# EAGLE design heater_motor (EAGLE 9.4.2)
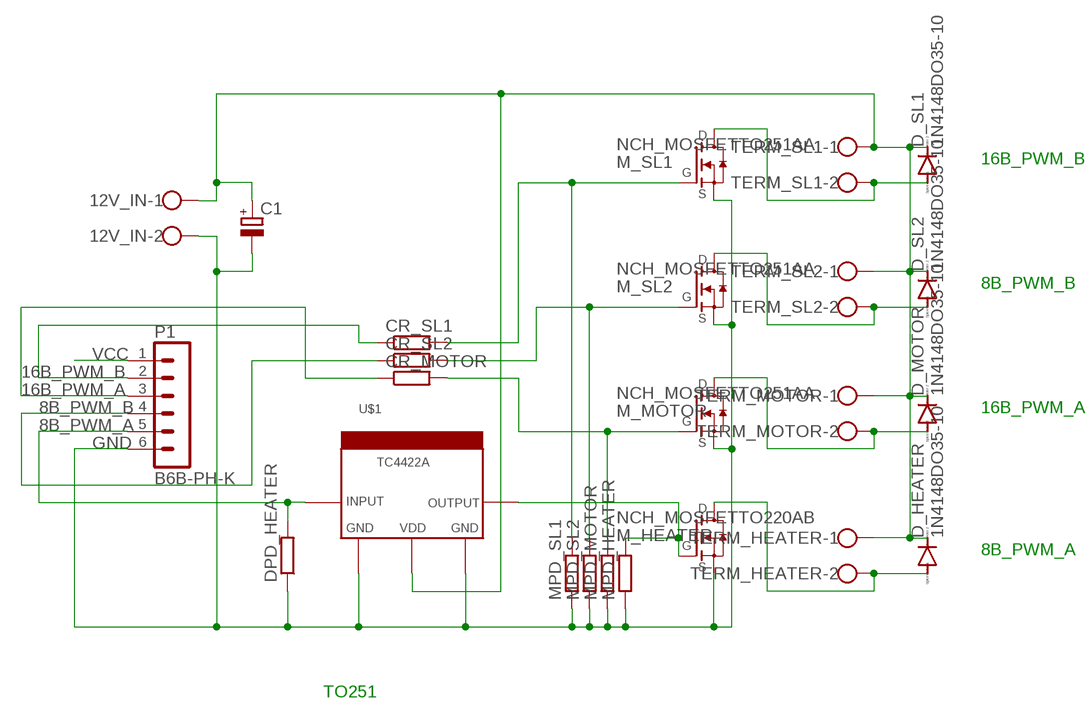
[diagram p0: schematic, sheet 1]

## Parts
12V_IN  W237-102  [W237-102]
C1  CPOL-EUE5-10.5  [E5-10,5]
CR_MOTOR  R-EU_0207/10  [0207/10]
CR_SL1  R-EU_0207/10  [0207/10]
CR_SL2  R-EU_0207/10  [0207/10]
D_HEATER  1N4148DO35-10  [DO35-10]
D_MOTOR  1N4148DO35-10  [DO35-10]
D_SL1  1N4148DO35-10  [DO35-10]
D_SL2  1N4148DO35-10  [DO35-10]
DPD_HEATER  R-EU_0207/10  [0207/10]
M_HEATER  NCH_MOSFETTO220AB  [TO220AB]
M_MOTOR  NCH_MOSFETTO251AA  [TO251AA]
M_SL1  NCH_MOSFETTO251AA  [TO251AA]
M_SL2  NCH_MOSFETTO251AA  [TO251AA]
MPD_HEATER  R-EU_0207/10  [0207/10]
MPD_MOTOR  R-EU_0207/10  [0207/10]
MPD_SL1  R-EU_0207/10  [0207/10]
MPD_SL2  R-EU_0207/10  [0207/10]
P1  B6B-PH-K  [B6B-PH-K]
TERM_HEATER  W237-102  [W237-102]
TERM_MOTOR  W237-102  [W237-102]
TERM_SL1  W237-102  [W237-102]
TERM_SL2  W237-102  [W237-102]
U$1  TC4422ASPACE_LEGS  [TO220-52]

## Nets
8B_PWM_A: DPD_HEATER.2 P1.5 U$1.1(INPUT)
8B_PWM_B: CR_SL2.1 P1.4
16B_PWM_A: CR_MOTOR.1 P1.3
16B_PWM_B: CR_SL1.1 P1.2
GND: 12V_IN.2 C1.- DPD_HEATER.1 M_HEATER.3(S) M_MOTOR.3(S) M_SL1.3(S) M_SL2.3(S) MPD_HEATER.1 MPD_MOTOR.1 MPD_SL1.1 MPD_SL2.1 P1.6 U$1.2(GND1) U$1.4(GND2)
N$1: D_HEATER.A M_HEATER.2(D) TERM_HEATER.2
N$3: M_HEATER.1(G) MPD_HEATER.2 U$1.5(OUTPUT)
N$4: D_SL1.A M_SL1.2(D) TERM_SL1.2
N$5: D_SL2.A M_SL2.2(D) TERM_SL2.2
N$6: D_MOTOR.A M_MOTOR.2(D) TERM_MOTOR.2
N$7: CR_MOTOR.2 M_MOTOR.1(G) MPD_MOTOR.2
N$8: CR_SL2.2 M_SL2.1(G) MPD_SL2.2
N$9: CR_SL1.2 M_SL1.1(G) MPD_SL1.2
N$14: 12V_IN.1 C1.+ D_HEATER.C D_MOTOR.C D_SL1.C D_SL2.C TERM_HEATER.1 TERM_MOTOR.1 TERM_SL1.1 TERM_SL2.1 U$1.3(VDD)
VCC: P1.1

## Notes on the sheet
- 16B_PWM_B
- 8B_PWM_B
- 16B_PWM_A
- 8B_PWM_A
- TO251

## Library data of the parts
12V_IN TERM_HEATER TERM_MOTOR TERM_SL1 TERM_SL2 = con-wago-500:W237-102: WAGO SCREW CLAMP; MPN: 237-102; OC_FARNELL: unknown; OC_NEWARK: 70K9898
C1 = rcl:CPOL-EU: POLARIZED CAPACITOR, European symbol; SPICEPREFIX: C
CR_MOTOR CR_SL1 CR_SL2 DPD_HEATER MPD_HEATER MPD_MOTOR MPD_SL1 MPD_SL2 = rcl:R-EU_: RESISTOR, European symbol; SPICEPREFIX: R
D_HEATER D_MOTOR D_SL1 D_SL2 = diode:1N4148: DIODE high speed (Philips)
M_HEATER M_MOTOR M_SL1 M_SL2 = custom_mosfets:NCH_MOSFET
P1 = con-jst-ph:B6B-PH-K: HEADER
U$1 = custom_mosfets:TC4422A

## Board
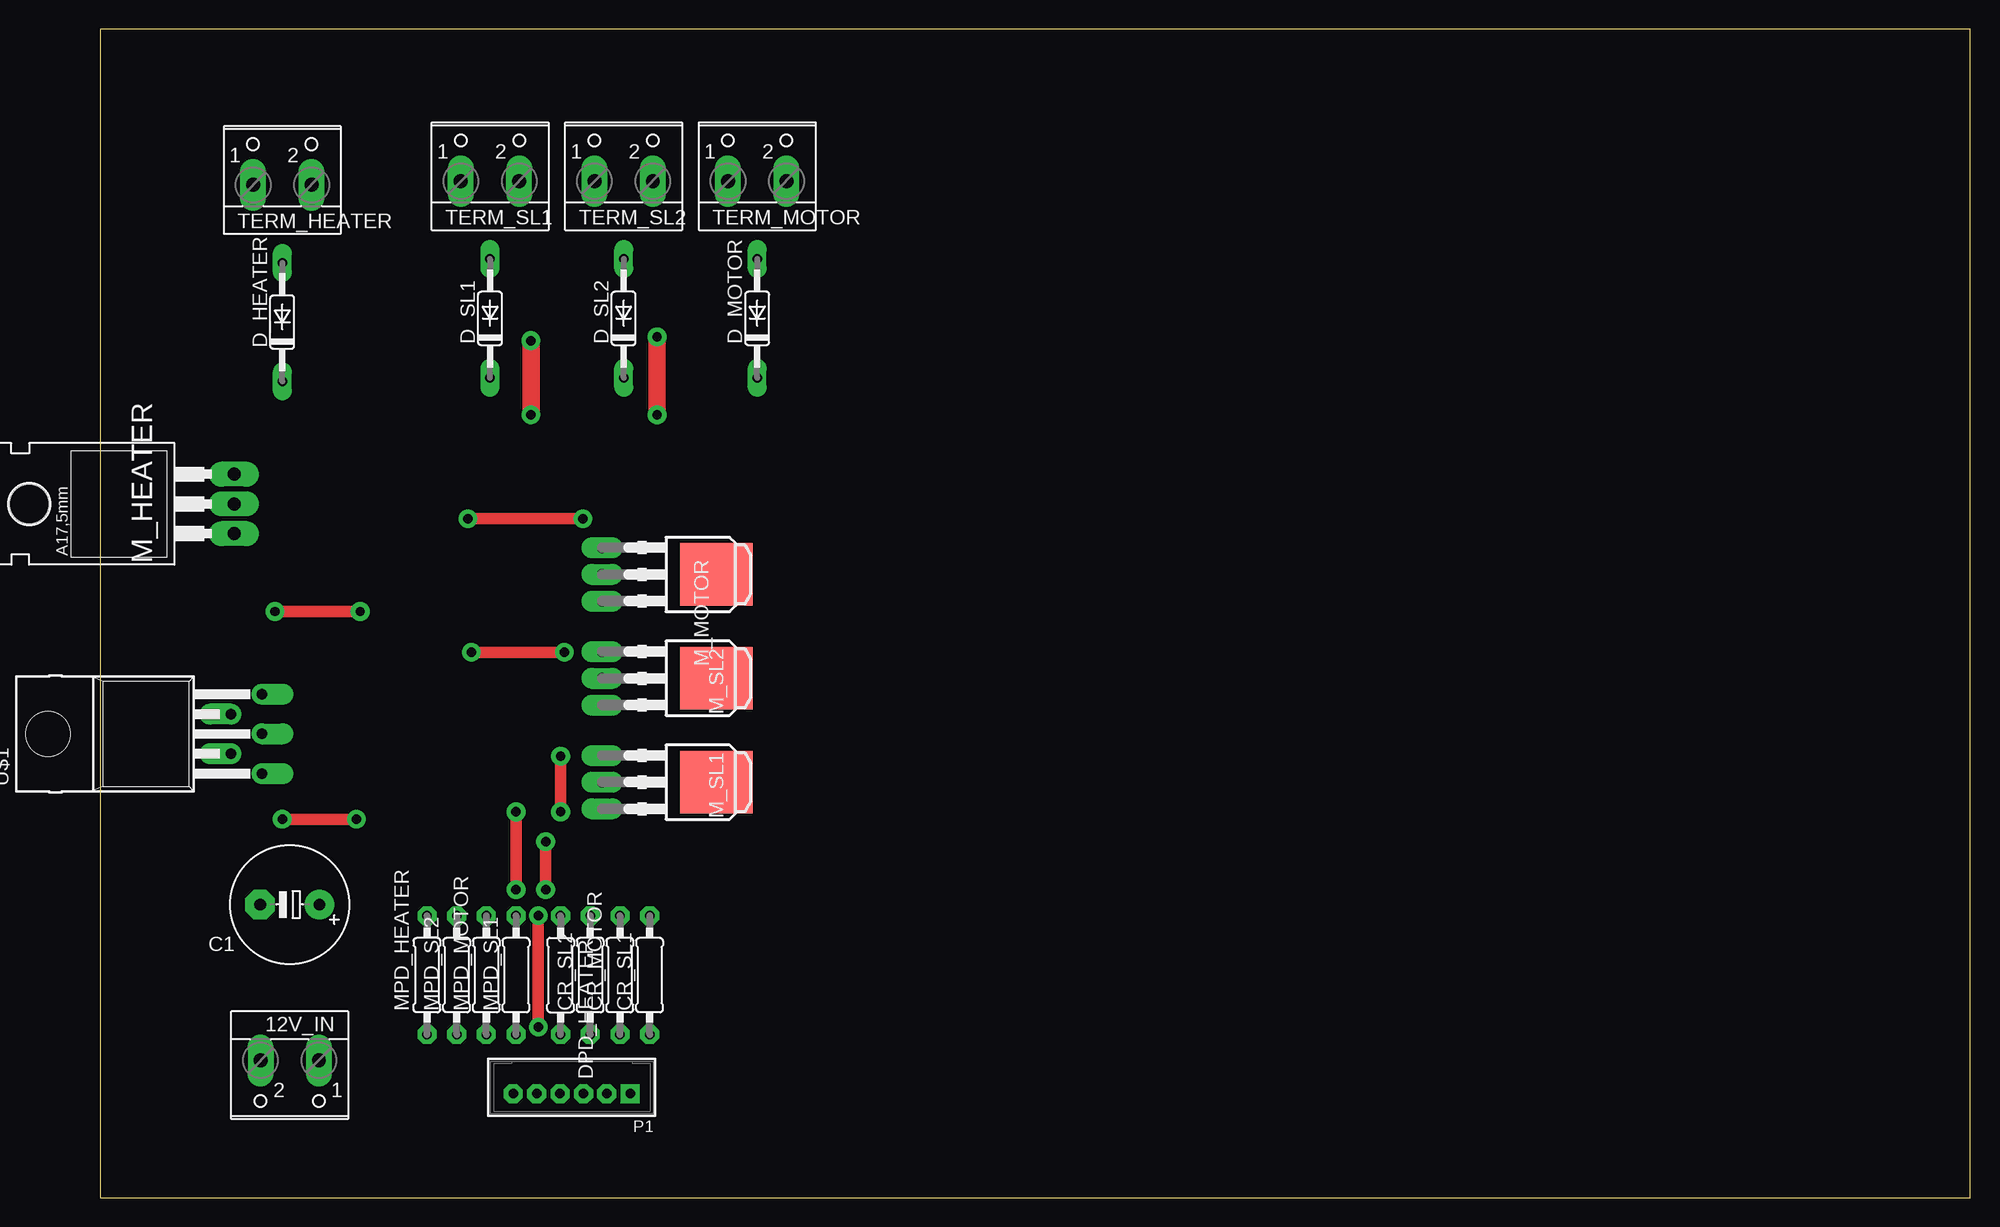
[diagram p1: board, top side]
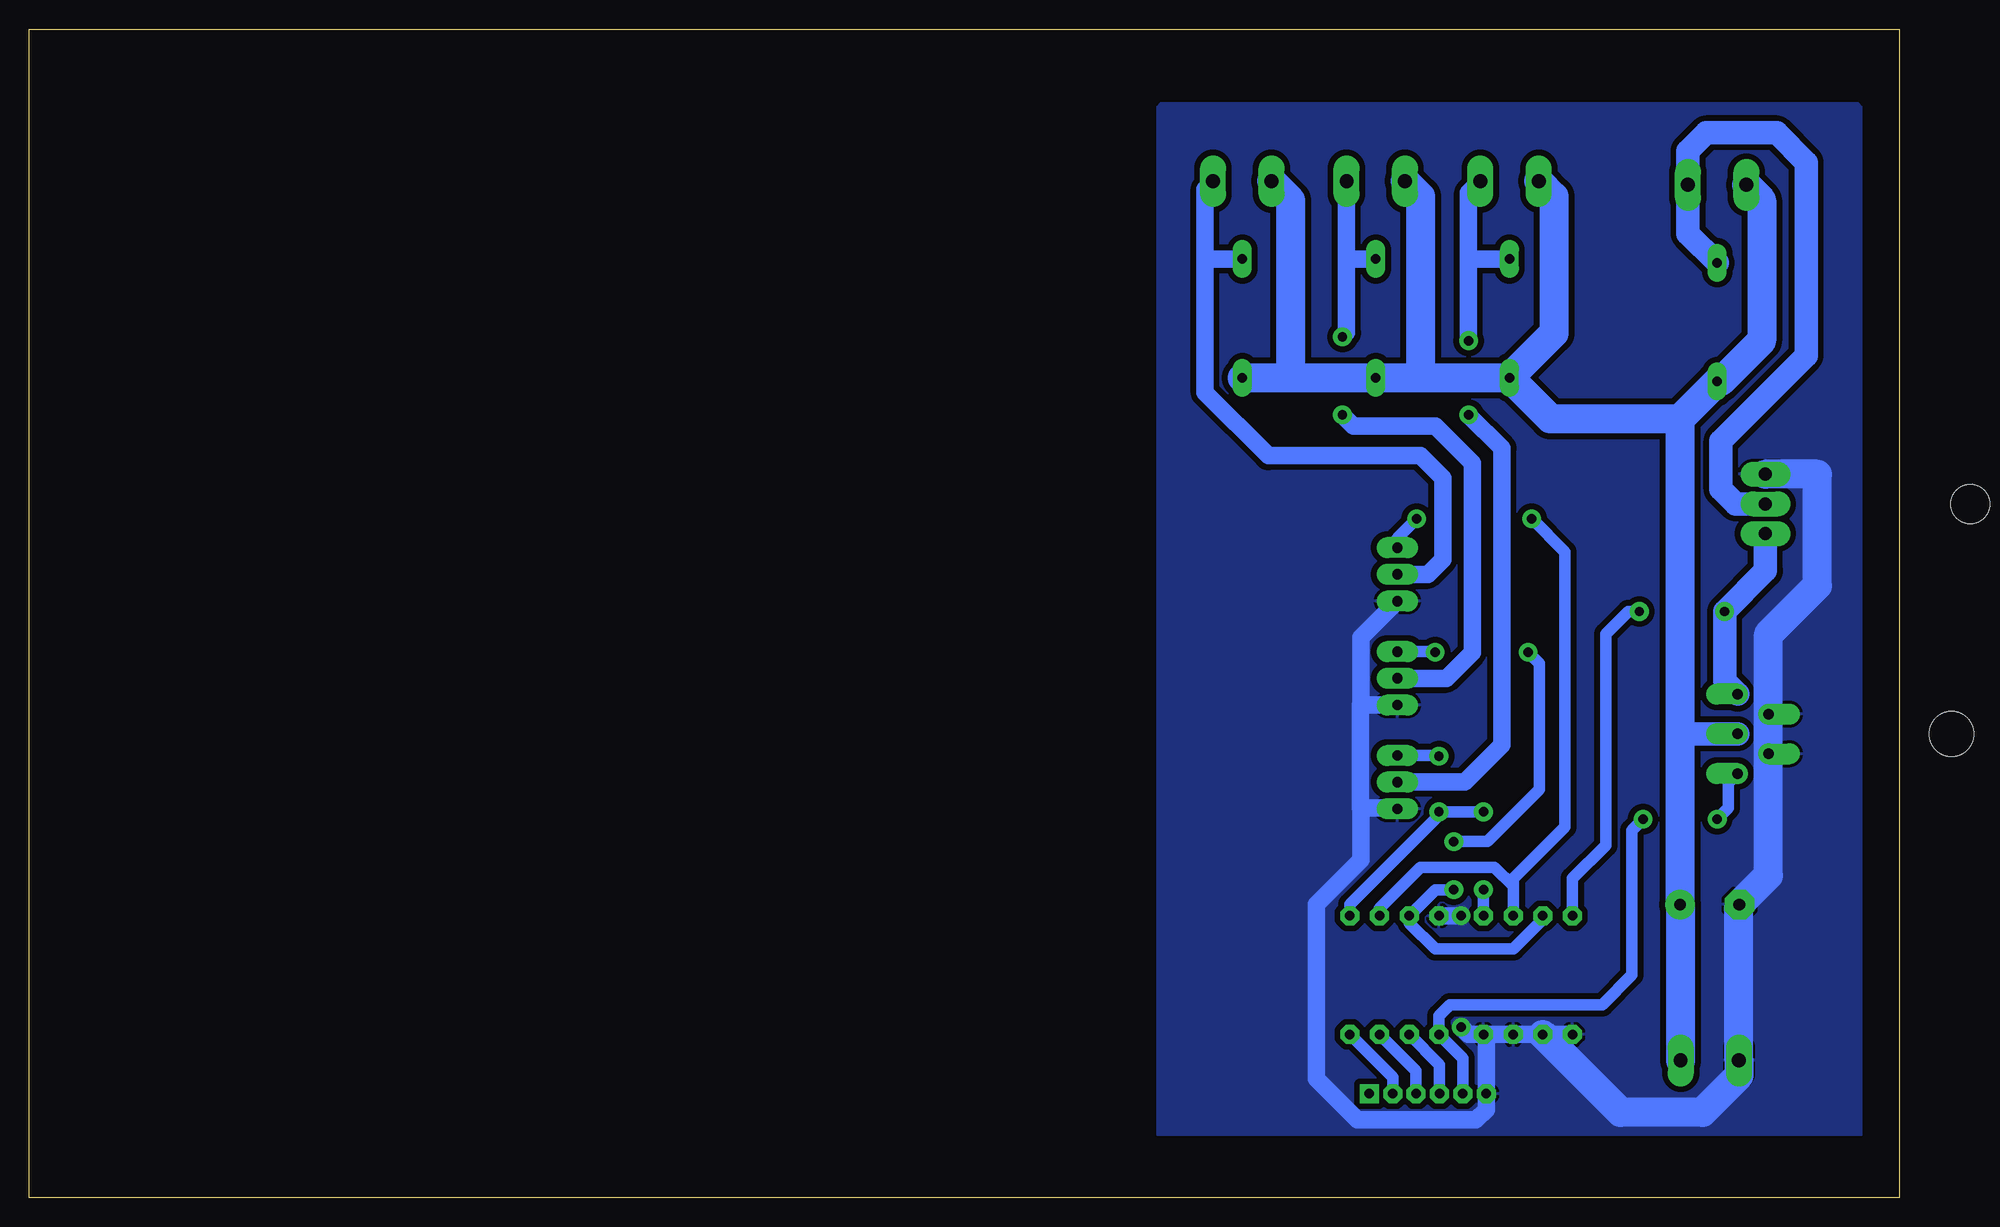
[diagram p2: board, bottom side, seen from below]

Size 160 x 100 mm. Coordinates in mm from the lower left corner, seen from the top.
Outline: 0,0 160,0 160,100 0,100 0,0
Copper layers (1*16): Top 0.035mm / dielectric 1.5mm / Bottom 0.035mm
Design rules "default *": minimum track width 6mil, minimum drill 0.65mm, track to track 6mil, track to pad 6mil, pad to pad 6mil, via to via 6mil, smd to smd 6mil, copper to edge 40mil, drill to drill 6mil, minimum pad ring 10mil, minimum via ring 8mil, stop-mask expansion 4mil, vias tented up to drill 0mil, thermal gap 10mil

### Footprints (pad centres in the part's own frame; a part is rotated, then mirrored left to right if it is on the bottom)
W237-102 = drill 1.194 long: 1 -2.5,-1.27; 2 2.5,-1.27
E5-10,5 = drill 1.016 pad 2.54: + -2.54,0 | drill 1.016 pad 2.54 octagon: - 2.54,0
0207/10 = drill 0.813 octagon: 1 -5.08,0; 2 5.08,0
DO35-10 = drill 0.813 long: A 5.08,0; C -5.08,0
TO220AB = drill 1.118 long: 1 -2.54,-6.35; 2 0,-6.35; 3 2.54,-6.35 | hole 3.302: 0,11.176
TO251AA = drill 0.889 long: 1 -2.286,-5.334; 2 0,-5.334; 3 2.286,-5.334 | smd 5.334 x 6.223: 4 0,4.445
B6B-PH-K = drill 0.813 square: 1 -5,0 | drill 0.813 octagon: 2 -3,0; 3 -1,0; 4 1,0; 5 3,0; 6 5,0
TO220-52 = drill 0.9 offset: 1 -3.4,-21.1; 2 -1.7,-18.47; 3 0,-21.1; 4 1.7,-18.47; 5 3.4,-21.1 | hole 3.8: 0,-2.8

### Placement (x,y rotation side)
12V_IN  16.19,10.48 180 top
C1  16.19,25.08 180 top
CR_MOTOR  44.45,19.05 90 top
CR_SL1  46.99,19.05 90 top
CR_SL2  41.91,19.05 90 top
D_HEATER  15.56,74.93 90 top
D_MOTOR  56.2,75.25 90 top
D_SL1  33.34,75.25 90 top
D_SL2  44.77,75.25 90 top
DPD_HEATER  39.37,19.05 270 top
M_HEATER  5.08,59.37 90 top
M_MOTOR  48.26,53.34 270 top
M_SL1  48.26,35.56 270 top
M_SL2  48.26,44.45 270 top
MPD_HEATER  27.94,19.05 90 top
MPD_MOTOR  33.02,19.05 90 top
MPD_SL1  35.56,19.05 90 top
MPD_SL2  30.48,19.05 90 top
P1  40.32,8.89 180 top
TERM_HEATER  15.56,87.95 0 top
TERM_MOTOR  56.2,88.27 0 top
TERM_SL1  33.34,88.27 0 top
TERM_SL2  44.77,88.27 0 top
U$1  -7.3,39.69 90 top

### Tracks (layer width: path | path; a pad name or v marks a point on that pad's centre or on a via)
8B_PWM_A  (via drill 0.8)
  Top 1: v15.56,32.38 v21.91,32.38
  Bottom 1: P1.5 37.32,11.92 DPD_HEATER.2 39.37,15.56 38.42,16.51 25.4,16.51 22.86,19.05 22.86,31.43 v21.91,32.38 | U$1.1 14.61,35.48 14.61,33.34 v15.56,32.38
8B_PWM_B
  Bottom 1: P1.4 39.32,11.38 CR_SL2.1
16B_PWM_A
  Bottom 1: P1.3 41.32,10.84 CR_MOTOR.1
16B_PWM_B
  Bottom 1: P1.2 43.32,10.3 CR_SL1.1
GND  (via drill 0.8)
  Top 1: v37.47,14.61 v37.47,24.13
  Bottom 1.5: MPD_SL1.1 MPD_MOTOR.1 MPD_SL2.1 MPD_HEATER.1 | 46.1,42.16 46.1,33.34 46.04,33.34 | M_MOTOR.3 46.04,47.94 46.04,42.16 M_SL2.3 | M_SL1.3 42.99,33.34 46.04,33.34 | 46.04,33.34 46.04,28.89 49.85,25.08 49.85,10.16 46.35,6.67 36.2,6.67 35.32,7.54 P1.6 35.32,13.73 MPD_SL1.1 | v37.47,24.13 DPD_HEATER.1 | v37.47,14.61 36.83,13.97 MPD_SL1.1
  Bottom 2.5: MPD_SL2.1 23.81,7.3 16.83,7.3 13.69,10.44 12V_IN.2 13.69,25.04 C1.- 11.17,27.57 U$1.2 U$1.4 11.17,48.2 6.99,52.39 6.99,61.91 M_HEATER.3
  pour Bottom (isolate 0.5): 3.49,93.66 63.18,93.66 63.5,93.34 63.5,5.4 3.17,5.4 3.17,93.34
N$1
  Bottom 2: M_HEATER.2 13.97,59.37 15.24,60.64 15.24,64.77 7.94,72.07 7.94,88.58 10.48,91.12 16.51,91.12 18.06,89.58 TERM_HEATER.2 18.06,82.51 D_HEATER.A
N$3  (via drill 0.8)
  Top 1: v22.23,50.16 v14.92,50.16
  Bottom 1: MPD_HEATER.2 27.94,27.3 25.08,30.16 25.08,48.26 23.18,50.16 v22.23,50.16
  Bottom 2: U$1.5 14.92,44.21 v14.92,50.16 11.43,53.66 M_HEATER.1
N$4  (via drill 0.8)
  Top 1.5: v36.83,66.99 v36.83,73.34
  Bottom 1.5: M_SL1.2 37.15,35.56 33.97,38.73 33.97,64.14 v36.83,66.99 | v36.83,73.34 36.83,80.33 | 36.83,80.33 36.83,86 TERM_SL1.2 | D_SL1.A 36.83,80.33
N$5  (via drill 0.8)
  Top 1.5: v47.62,66.99 v47.62,73.66
  Bottom 1.5: M_SL2.2 38.73,44.45 36.51,46.67 36.51,62.87 39.69,66.04 46.67,66.04 v47.62,66.99 | v47.62,73.66 47.27,74.02 47.27,80.33 | 47.27,80.33 TERM_SL2.2 | D_SL2.A 47.27,80.33
N$6
  Bottom 1.5: M_MOTOR.2 40.32,53.34 39.05,54.61 39.05,61.59 40.96,63.5 53.98,63.5 59.37,68.9 59.37,80.33 | TERM_MOTOR.2 59.37,86.32 59.37,80.33 | D_MOTOR.A 59.37,80.33
N$7  (via drill 0.8)
  Top 1: v31.43,58.1 v41.27,58.1
  Bottom 1: MPD_MOTOR.2 33.02,26.67 | 33.02,26.67 34.61,28.26 40.96,28.26 44.45,24.77 CR_MOTOR.2 | 33.02,26.67 33.02,27.3 28.57,31.75 28.57,55.24 v31.43,58.1 | v41.27,58.1 42.93,56.45 M_MOTOR.1
N$8  (via drill 0.8)
  Top 1: v38.1,26.35 v38.1,30.48 | v31.75,46.67 v39.69,46.67
  Bottom 1: MPD_SL2.2 30.48,23.81 33.02,21.27 39.69,21.27 41.91,23.5 CR_SL2.2 39.69,26.35 v38.1,26.35 | v38.1,30.48 35.24,30.48 30.8,34.92 30.8,45.72 v31.75,46.67 | v39.69,46.67 39.75,46.74 M_SL2.1
N$9  (via drill 0.8)
  Top 1: v39.37,33.02 v39.37,37.78 | v35.56,26.35 v35.56,33.02
  Bottom 1: CR_SL1.2 46.99,25.08 39.37,32.7 v39.37,33.02 | 39.37,33.34 v39.37,33.02 | v39.37,37.78 39.43,37.85 M_SL1.1 | MPD_SL1.2 v35.56,26.35 | v35.56,33.02 v39.37,33.02
N$14
  Bottom 2: U$1.3 18.73,39.69
  Bottom 2.5: 12V_IN.1 18.69,25.04 C1.+ 18.73,39.69 18.73,66.67 | 18.73,66.67 D_HEATER.C 15.24,69.85 11.75,73.34 11.75,85.37 TERM_HEATER.1 | D_SL1.C 29.84,66.67 18.73,66.67 | 40.96,70.17 D_SL2.C 52.07,70.17 | 40.96,70.17 D_SL1.C | D_MOTOR.C 52.07,70.17 | TERM_SL1.1 29.53,85.69 29.53,73.98 D_SL1.C | TERM_SL2.1 40.96,85.69 40.96,70.17 | TERM_MOTOR.1 52.07,85.37 52.07,70.17